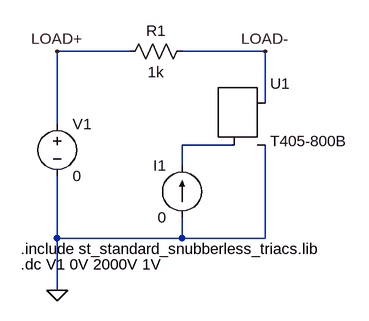
[diagram p0: schematic 3EEC_VELASCO_EXPT6_CKT2.asc]
3EEC_VELASCO_EXPT6_CKT2.asc, the LTspice schematic file:
Version 4
SHEET 1 880 680
WIRE 208 64 96 64
WIRE 416 64 288 64
WIRE 416 144 416 64
WIRE 96 176 96 64
WIRE 368 208 288 208
WIRE 288 240 288 208
WIRE 96 352 96 256
WIRE 288 352 288 320
WIRE 288 352 96 352
WIRE 416 352 416 208
WIRE 416 352 288 352
WIRE 96 432 96 352
FLAG 96 64 LOAD+
FLAG 416 64 LOAD-
FLAG 96 432 0
SYMBOL current 288 320 R180
WINDOW 0 24 80 Left 2
WINDOW 3 24 0 Left 2
SYMATTR InstName I1
SYMATTR Value 0
SYMBOL Misc\\TRIAC 384 144 R0
SYMATTR InstName U1
SYMATTR Value T405-800B
SYMBOL res 304 48 R90
WINDOW 0 0 56 VBottom 2
WINDOW 3 32 56 VTop 2
SYMATTR InstName R1
SYMATTR Value 1k
SYMBOL voltage 96 160 R0
SYMATTR InstName V1
SYMATTR Value 0
TEXT 40 368 Left 2 !.include st_standard_snubberless_triacs.lib
TEXT 40 392 Left 2 !.dc V1 0V 2000V 1V

The netlist it stands for:
* 3EEC_VELASCO_EXPT6_CKT2.asc
I1 0 N001 0
XU1 LOAD- N001 0 T405-800B  ; pins MT2 G MT1
R1 LOAD- LOAD+ 1k
V1 LOAD+ 0 0
.include st_standard_snubberless_triacs.lib
.dc V1 0V 2000V 1V
.backanno
.end